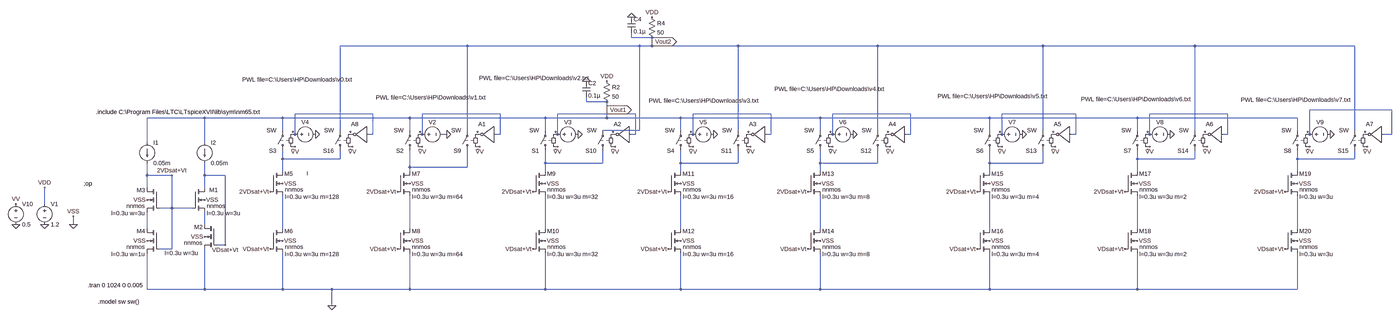
[diagram p0: schematic Sin DAC Differential.asc, whole sheet]
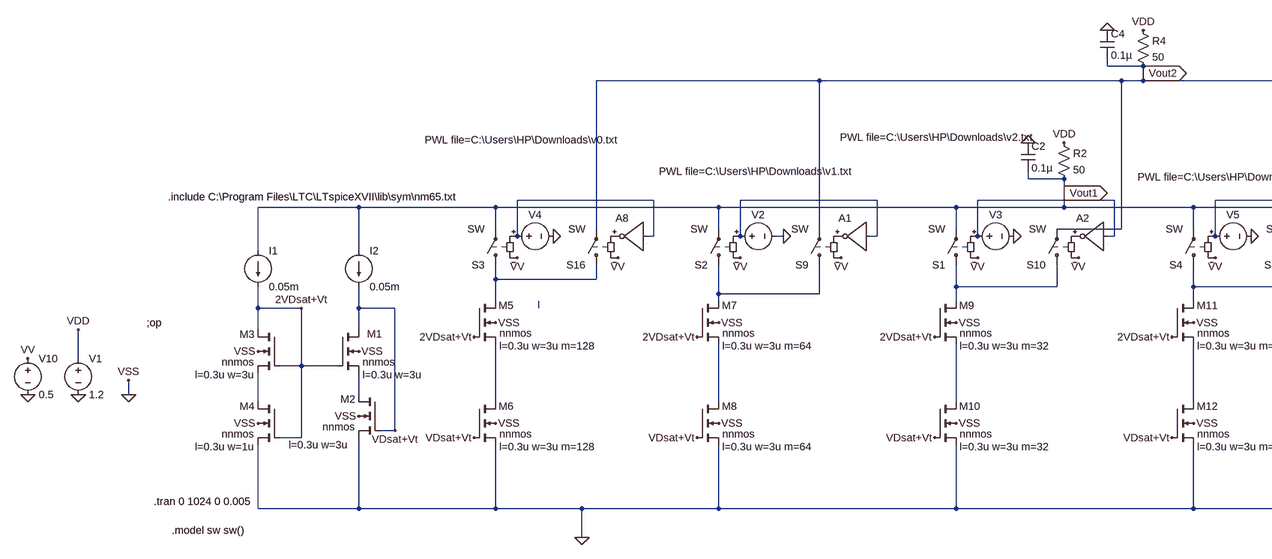
[diagram p1: schematic Sin DAC Differential.asc, part, row 1 of 1, column 1 of 2]
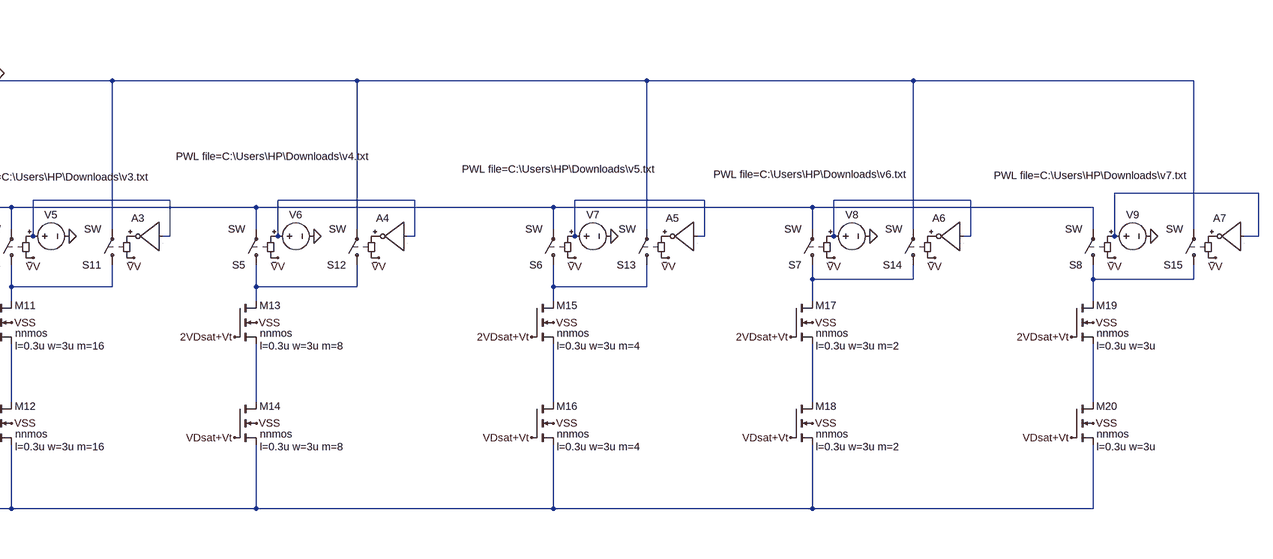
[diagram p2: schematic Sin DAC Differential.asc, part, row 1 of 1, column 2 of 2]
Sin DAC Differential.asc, the LTspice schematic file:
Version 4
SHEET 1 3460 680
WIRE 480 -576 480 -592
WIRE 560 -576 480 -576
WIRE 560 -560 560 -576
WIRE -160 -544 -656 -544
WIRE 512 -544 -160 -544
WIRE 560 -544 560 -560
WIRE 560 -544 512 -544
WIRE 896 -544 560 -544
WIRE 1440 -544 896 -544
WIRE 2096 -544 1440 -544
WIRE 2688 -544 2096 -544
WIRE 3312 -544 2688 -544
WIRE 304 -304 304 -320
WIRE 384 -304 304 -304
WIRE 384 -272 384 -304
WIRE 3456 -272 3136 -272
WIRE -528 -256 -832 -256
WIRE -32 -256 -336 -256
WIRE 496 -256 192 -256
WIRE 1024 -256 720 -256
WIRE 1568 -256 1264 -256
WIRE 2224 -256 1936 -256
WIRE 2816 -256 2512 -256
WIRE -1184 -240 -1408 -240
WIRE -880 -240 -1184 -240
WIRE -384 -240 -880 -240
WIRE 144 -240 -384 -240
WIRE 384 -240 384 -272
WIRE 384 -240 144 -240
WIRE 672 -240 384 -240
WIRE 1216 -240 672 -240
WIRE 1888 -240 1216 -240
WIRE 2464 -240 1888 -240
WIRE 3088 -240 2464 -240
WIRE -880 -192 -880 -240
WIRE -656 -192 -656 -544
WIRE -384 -192 -384 -240
WIRE -160 -192 -160 -544
WIRE 144 -192 144 -240
WIRE 512 -192 512 -544
WIRE 512 -192 368 -192
WIRE 672 -192 672 -240
WIRE 896 -192 896 -544
WIRE 1216 -192 1216 -240
WIRE 1440 -192 1440 -544
WIRE 1888 -192 1888 -240
WIRE 2096 -192 2096 -544
WIRE 2464 -192 2464 -240
WIRE 2688 -192 2688 -544
WIRE 3088 -192 3088 -240
WIRE 3312 -192 3312 -544
WIRE -832 -176 -832 -256
WIRE -528 -176 -528 -256
WIRE -528 -176 -544 -176
WIRE -336 -176 -336 -256
WIRE -240 -176 -256 -176
WIRE -32 -176 -32 -256
WIRE -32 -176 -48 -176
WIRE 192 -176 192 -256
WIRE 496 -176 496 -256
WIRE 496 -176 480 -176
WIRE 720 -176 720 -256
WIRE 1024 -176 1024 -256
WIRE 1024 -176 1008 -176
WIRE 1264 -176 1264 -256
WIRE 1568 -176 1568 -256
WIRE 1568 -176 1552 -176
WIRE 1936 -176 1936 -256
WIRE 2224 -176 2224 -256
WIRE 2224 -176 2208 -176
WIRE 2512 -176 2512 -256
WIRE 2816 -176 2816 -256
WIRE 2816 -176 2800 -176
WIRE 3136 -176 3136 -272
WIRE 3456 -176 3456 -272
WIRE 3456 -176 3424 -176
WIRE -1408 -144 -1408 -240
WIRE -1184 -144 -1184 -240
WIRE -880 -80 -880 -112
WIRE -656 -80 -656 -112
WIRE -656 -80 -880 -80
WIRE 2464 -80 2464 -112
WIRE 2688 -80 2688 -112
WIRE 2688 -80 2464 -80
WIRE 3088 -80 3088 -112
WIRE 3312 -80 3312 -112
WIRE 3312 -80 3088 -80
WIRE 144 -64 144 -112
WIRE 368 -64 368 -112
WIRE 368 -64 144 -64
WIRE 672 -64 672 -112
WIRE 896 -64 896 -112
WIRE 896 -64 672 -64
WIRE 1216 -64 1216 -112
WIRE 1440 -64 1440 -112
WIRE 1440 -64 1216 -64
WIRE 1888 -64 1888 -112
WIRE 2096 -64 2096 -112
WIRE 2096 -64 1888 -64
WIRE -384 -48 -384 -112
WIRE -160 -48 -160 -112
WIRE -160 -48 -384 -48
WIRE -880 -32 -880 -80
WIRE -384 -32 -384 -48
WIRE 144 -32 144 -64
WIRE 672 -32 672 -64
WIRE 1216 -32 1216 -64
WIRE 1888 -32 1888 -64
WIRE 2464 -32 2464 -80
WIRE 3088 -32 3088 -80
WIRE -1408 -16 -1408 -64
WIRE -1312 -16 -1408 -16
WIRE -1184 -16 -1184 -64
WIRE -1104 -16 -1184 -16
WIRE -784 -16 -784 -32
WIRE -1408 32 -1408 -16
WIRE -1184 32 -1184 -16
WIRE -1808 96 -1808 32
WIRE -1312 112 -1312 -16
WIRE -1312 112 -1360 112
WIRE -1232 112 -1312 112
WIRE -1696 176 -1696 144
WIRE -1184 176 -1184 128
WIRE -1408 192 -1408 128
WIRE -880 192 -880 64
WIRE -384 192 -384 64
WIRE 144 192 144 64
WIRE 672 192 672 64
WIRE 1216 192 1216 64
WIRE 1888 192 1888 64
WIRE 2464 192 2464 64
WIRE 3088 192 3088 64
WIRE -1104 256 -1104 -16
WIRE -1104 256 -1136 256
WIRE -1312 272 -1312 112
WIRE -1312 272 -1360 272
WIRE -1408 480 -1408 288
WIRE -1184 480 -1184 272
WIRE -1184 480 -1408 480
WIRE -880 480 -880 288
WIRE -880 480 -1184 480
WIRE -688 480 -880 480
WIRE -384 480 -384 288
WIRE -384 480 -688 480
WIRE 144 480 144 288
WIRE 144 480 -384 480
WIRE 672 480 672 288
WIRE 672 480 144 480
WIRE 1216 480 1216 288
WIRE 1216 480 672 480
WIRE 1888 480 1888 288
WIRE 1888 480 1216 480
WIRE 2464 480 2464 288
WIRE 2464 480 1888 480
WIRE 3088 480 3088 288
WIRE 3088 480 2464 480
WIRE -688 544 -688 480
FLAG -1696 176 0
FLAG -1184 80 VSS
FLAG -1184 224 VSS
FLAG -1408 80 VSS
FLAG -1408 240 VSS
FLAG -880 16 VSS
FLAG -880 240 VSS
FLAG -1696 144 VSS
FLAG -1312 -16 2VDsat+Vt
FLAG -928 48 2VDsat+Vt
FLAG -1104 256 VDsat+Vt
FLAG -1808 176 0
FLAG -1808 32 VDD
FLAG -384 16 VSS
FLAG -384 240 VSS
FLAG -432 48 2VDsat+Vt
FLAG 144 16 VSS
FLAG 144 240 VSS
FLAG 96 48 2VDsat+Vt
FLAG -432 272 VDsat+Vt
FLAG 96 272 VDsat+Vt
FLAG -752 -176 0
FLAG -240 -176 0
FLAG 272 -176 0
FLAG -928 272 VDsat+Vt
FLAG 672 16 VSS
FLAG 672 240 VSS
FLAG 624 48 2VDsat+Vt
FLAG 624 272 VDsat+Vt
FLAG 800 -176 0
FLAG 1216 16 VSS
FLAG 1216 240 VSS
FLAG 1168 48 2VDsat+Vt
FLAG 1168 272 VDsat+Vt
FLAG 1344 -176 0
FLAG 1888 16 VSS
FLAG 1888 240 VSS
FLAG 1840 48 2VDsat+Vt
FLAG 1840 272 VDsat+Vt
FLAG 2016 -176 0
FLAG 2464 16 VSS
FLAG 2464 240 VSS
FLAG 2416 48 2VDsat+Vt
FLAG 2416 272 VDsat+Vt
FLAG 2592 -176 0
FLAG 3088 16 VSS
FLAG 3088 240 VSS
FLAG 3040 48 2VDsat+Vt
FLAG 3040 272 VDsat+Vt
FLAG 3216 -176 0
FLAG -688 544 0
FLAG -1920 176 0
FLAG -1920 96 VV
FLAG -832 -128 VV
FLAG -336 -128 VV
FLAG 192 -128 VV
FLAG 720 -128 VV
FLAG 1264 -128 VV
FLAG 1936 -128 VV
FLAG 2512 -128 VV
FLAG 3136 -128 VV
FLAG 384 -384 VDD
FLAG 384 -272 Vout1
IOPIN 384 -272 Out
FLAG 304 -384 0
FLAG 560 -656 VDD
FLAG 480 -656 0
FLAG -112 -128 VV
FLAG 416 -128 VV
FLAG 944 -128 VV
FLAG 1488 -128 VV
FLAG 2144 -128 VV
FLAG 2736 -128 VV
FLAG 3360 -128 VV
FLAG -608 -128 VV
FLAG 560 -560 Vout2
IOPIN 560 -560 Out
SYMBOL nmos4 -1232 32 R0
WINDOW 123 56 100 Left 2
WINDOW 0 66 9 Left 2
SYMATTR Value2 l=0.3u w=3u
SYMATTR InstName M1
SYMATTR Value nnmos
SYMBOL nmos4 -1136 176 M0
WINDOW 123 72 112 Left 2
WINDOW 0 55 10 Left 2
SYMATTR Value2 l=0.3u w=3u
SYMATTR InstName M2
SYMATTR Value nnmos
SYMBOL nmos4 -1360 32 M0
WINDOW 123 56 100 Left 2
WINDOW 0 55 10 Left 2
SYMATTR Value2 l=0.3u w=3u
SYMATTR InstName M3
SYMATTR Value nnmos
SYMBOL nmos4 -1360 192 M0
WINDOW 123 56 100 Left 2
WINDOW 0 55 10 Left 2
SYMATTR Value2 l=0.3u w=1u
SYMATTR InstName M4
SYMATTR Value nnmos
SYMBOL nmos4 -928 -32 R0
WINDOW 123 56 100 Left 2
WINDOW 0 55 10 Left 2
SYMATTR Value2 l=0.3u w=3u m=128
SYMATTR InstName M5
SYMATTR Value nnmos
SYMBOL nmos4 -928 192 R0
WINDOW 123 56 100 Left 2
WINDOW 0 55 10 Left 2
SYMATTR Value2 l=0.3u w=3u m=128
SYMATTR InstName M6
SYMATTR Value nnmos
SYMBOL current -1408 -144 R0
WINDOW 123 0 0 Left 0
WINDOW 39 0 0 Left 0
SYMATTR InstName I1
SYMATTR Value 0.05m
SYMBOL current -1184 -144 R0
WINDOW 123 0 0 Left 0
WINDOW 39 0 0 Left 0
SYMATTR InstName I2
SYMATTR Value 0.05m
SYMBOL voltage -1808 80 R0
WINDOW 123 0 0 Left 0
WINDOW 39 0 0 Left 0
SYMATTR InstName V1
SYMATTR Value 1.2
SYMBOL nmos4 -432 -32 R0
WINDOW 123 56 100 Left 2
WINDOW 0 55 10 Left 2
SYMATTR Value2 l=0.3u w=3u m=64
SYMATTR InstName M7
SYMATTR Value nnmos
SYMBOL nmos4 -432 192 R0
WINDOW 123 56 100 Left 2
WINDOW 0 55 10 Left 2
SYMATTR Value2 l=0.3u w=3u m=64
SYMATTR InstName M8
SYMATTR Value nnmos
SYMBOL nmos4 96 -32 R0
WINDOW 123 56 100 Left 2
WINDOW 0 55 10 Left 2
SYMATTR Value2 l=0.3u w=3u m=32
SYMATTR InstName M9
SYMATTR Value nnmos
SYMBOL nmos4 96 192 R0
WINDOW 123 56 100 Left 2
WINDOW 0 55 10 Left 2
SYMATTR Value2 l=0.3u w=3u m=32
SYMATTR InstName M10
SYMATTR Value nnmos
SYMBOL voltage -352 -176 M90
WINDOW 0 -32 56 VBottom 2
WINDOW 3 -160 49 VTop 2
WINDOW 123 0 0 Left 0
WINDOW 39 0 0 Left 0
SYMATTR InstName V2
SYMATTR Value PWL file=C:\Users\HP\Downloads\v1.txt
SYMBOL voltage 176 -176 M90
WINDOW 0 -32 56 VBottom 2
WINDOW 3 -236 -76 VTop 2
WINDOW 123 0 0 Left 0
WINDOW 39 0 0 Left 0
SYMATTR InstName V3
SYMATTR Value PWL file=C:\Users\HP\Downloads\v2.txt
SYMBOL voltage -848 -176 M90
WINDOW 0 -32 56 VBottom 2
WINDOW 3 -230 24 VTop 2
WINDOW 123 0 0 Left 0
WINDOW 39 0 0 Left 0
SYMATTR InstName V4
SYMATTR Value PWL file=C:\Users\HP\Downloads\v0.txt
SYMBOL sw 144 -96 R180
SYMATTR InstName S1
SYMBOL sw -384 -96 R180
SYMATTR InstName S2
SYMBOL sw -880 -96 R180
SYMATTR InstName S3
SYMBOL nmos4 624 -32 R0
WINDOW 123 56 100 Left 2
WINDOW 0 55 10 Left 2
SYMATTR Value2 l=0.3u w=3u m=16
SYMATTR InstName M11
SYMATTR Value nnmos
SYMBOL nmos4 624 192 R0
WINDOW 123 56 100 Left 2
WINDOW 0 55 10 Left 2
SYMATTR Value2 l=0.3u w=3u m=16
SYMATTR InstName M12
SYMATTR Value nnmos
SYMBOL voltage 704 -176 M90
WINDOW 0 -32 56 VBottom 2
WINDOW 3 -147 57 VTop 2
WINDOW 123 0 0 Left 0
WINDOW 39 0 0 Left 0
SYMATTR InstName V5
SYMATTR Value PWL file=C:\Users\HP\Downloads\v3.txt
SYMBOL sw 672 -96 R180
SYMATTR InstName S4
SYMBOL nmos4 1168 -32 R0
WINDOW 123 56 100 Left 2
WINDOW 0 55 10 Left 2
SYMATTR Value2 l=0.3u w=3u m=8
SYMATTR InstName M13
SYMATTR Value nnmos
SYMBOL nmos4 1168 192 R0
WINDOW 123 56 100 Left 2
WINDOW 0 55 10 Left 2
SYMATTR Value2 l=0.3u w=3u m=8
SYMATTR InstName M14
SYMATTR Value nnmos
SYMBOL voltage 1248 -176 M90
WINDOW 0 -32 56 VBottom 2
WINDOW 3 -193 3 VTop 2
WINDOW 123 0 0 Left 0
WINDOW 39 0 0 Left 0
SYMATTR InstName V6
SYMATTR Value PWL file=C:\Users\HP\Downloads\v4.txt
SYMBOL sw 1216 -96 R180
SYMATTR InstName S5
SYMBOL nmos4 1840 -32 R0
WINDOW 123 56 100 Left 2
WINDOW 0 55 10 Left 2
SYMATTR Value2 l=0.3u w=3u m=4
SYMATTR InstName M15
SYMATTR Value nnmos
SYMBOL nmos4 1840 192 R0
WINDOW 123 56 100 Left 2
WINDOW 0 55 10 Left 2
SYMATTR Value2 l=0.3u w=3u m=4
SYMATTR InstName M16
SYMATTR Value nnmos
SYMBOL voltage 1920 -176 M90
WINDOW 0 -32 56 VBottom 2
WINDOW 3 -165 -21 VTop 2
WINDOW 123 0 0 Left 0
WINDOW 39 0 0 Left 0
SYMATTR InstName V7
SYMATTR Value PWL file=C:\Users\HP\Downloads\v5.txt
SYMBOL sw 1888 -96 R180
SYMATTR InstName S6
SYMBOL nmos4 2416 -32 R0
WINDOW 123 56 100 Left 2
WINDOW 0 55 10 Left 2
SYMATTR Value2 l=0.3u w=3u m=2
SYMATTR InstName M17
SYMATTR Value nnmos
SYMBOL nmos4 2416 192 R0
WINDOW 123 56 100 Left 2
WINDOW 0 55 10 Left 2
SYMATTR Value2 l=0.3u w=3u m=2
SYMATTR InstName M18
SYMATTR Value nnmos
SYMBOL voltage 2496 -176 M90
WINDOW 0 -32 56 VBottom 2
WINDOW 3 -153 -38 VTop 2
WINDOW 123 0 0 Left 0
WINDOW 39 0 0 Left 0
SYMATTR InstName V8
SYMATTR Value PWL file=C:\Users\HP\Downloads\v6.txt
SYMBOL sw 2464 -96 R180
SYMATTR InstName S7
SYMBOL nmos4 3040 -32 R0
WINDOW 123 56 100 Left 2
WINDOW 0 55 10 Left 2
SYMATTR Value2 l=0.3u w=3u
SYMATTR InstName M19
SYMATTR Value nnmos
SYMBOL nmos4 3040 192 R0
WINDOW 123 56 100 Left 2
WINDOW 0 55 10 Left 2
SYMATTR Value2 l=0.3u w=3u
SYMATTR InstName M20
SYMATTR Value nnmos
SYMBOL voltage 3120 -176 M90
WINDOW 0 -32 56 VBottom 2
WINDOW 3 -151 -39 VTop 2
WINDOW 123 0 0 Left 0
WINDOW 39 0 0 Left 0
SYMATTR InstName V9
SYMATTR Value PWL file=C:\Users\HP\Downloads\v7.txt
SYMBOL sw 3088 -96 R180
SYMATTR InstName S8
SYMBOL voltage -1920 80 R0
WINDOW 123 0 0 Left 0
WINDOW 39 0 0 Left 0
SYMATTR InstName V10
SYMATTR Value 0.5
SYMBOL sw -160 -96 R180
SYMATTR InstName S9
SYMBOL sw 368 -96 R180
SYMATTR InstName S10
SYMBOL sw 896 -96 R180
SYMATTR InstName S11
SYMBOL sw 1440 -96 R180
SYMATTR InstName S12
SYMBOL sw 2096 -96 R180
SYMATTR InstName S13
SYMBOL sw 2688 -96 R180
SYMATTR InstName S14
SYMBOL sw 3312 -96 R180
SYMATTR InstName S15
SYMBOL cap 288 -384 R0
SYMATTR InstName C2
SYMATTR Value 0.1µ
SYMBOL res 368 -400 R0
SYMATTR InstName R2
SYMATTR Value 50
SYMBOL cap 464 -656 R0
SYMATTR InstName C4
SYMATTR Value 0.1µ
SYMBOL res 544 -672 R0
SYMATTR InstName R4
SYMATTR Value 50
SYMBOL Digital\\inv -48 -240 M0
SYMATTR InstName A1
SYMBOL Digital\\inv 480 -240 M0
SYMATTR InstName A2
SYMBOL Digital\\inv 1008 -240 M0
SYMATTR InstName A3
SYMBOL Digital\\inv 1552 -240 M0
SYMATTR InstName A4
SYMBOL Digital\\inv 2208 -240 M0
SYMATTR InstName A5
SYMBOL Digital\\inv 2800 -240 M0
SYMATTR InstName A6
SYMBOL Digital\\inv 3424 -240 M0
SYMATTR InstName A7
SYMBOL sw -656 -96 R180
SYMATTR InstName S16
SYMBOL Digital\\inv -544 -240 M0
SYMATTR InstName A8
TEXT -1608 -264 Left 2 !.include C:\\Program Files\\LTC\\LTspiceXVII\\lib\\sym\\nm65.txt
TEXT -1656 16 Left 2 !;op
TEXT -1640 464 Left 2 !.tran 0 1024 0 0.005
TEXT -1600 528 Left 2 !.model sw sw()

The netlist it stands for:
* Sin DAC Differential.asc
M1 VDsat+Vt 2VDsat+Vt N018 0 nnmos l=0.3u w=3u
M2 N018 VDsat+Vt 0 0 nnmos l=0.3u w=3u
M3 2VDsat+Vt 2VDsat+Vt N019 0 nnmos l=0.3u w=3u
M4 N019 2VDsat+Vt 0 0 nnmos l=0.3u w=1u
M5 N009 2VDsat+Vt N020 0 nnmos l=0.3u w=3u m=128
M6 N020 VDsat+Vt 0 0 nnmos l=0.3u w=3u m=128
I1 Vout1 2VDsat+Vt 0.05m
I2 Vout1 VDsat+Vt 0.05m
V1 VDD 0 1.2
M7 N016 2VDsat+Vt N021 0 nnmos l=0.3u w=3u m=64
M8 N021 VDsat+Vt 0 0 nnmos l=0.3u w=3u m=64
M9 N012 2VDsat+Vt N022 0 nnmos l=0.3u w=3u m=32
M10 N022 VDsat+Vt 0 0 nnmos l=0.3u w=3u m=32
V2 N003 0 PWL file=C:\Users\HP\Downloads\v1.txt
V3 N004 0 PWL file=C:\Users\HP\Downloads\v2.txt
V4 N002 0 PWL file=C:\Users\HP\Downloads\v0.txt
S1 N012 Vout1 N004 VV SW
S2 N016 Vout1 N003 VV SW
S3 N009 Vout1 N002 VV SW
M11 N013 2VDsat+Vt N023 0 nnmos l=0.3u w=3u m=16
M12 N023 VDsat+Vt 0 0 nnmos l=0.3u w=3u m=16
V5 N005 0 PWL file=C:\Users\HP\Downloads\v3.txt
S4 N013 Vout1 N005 VV SW
M13 N014 2VDsat+Vt N024 0 nnmos l=0.3u w=3u m=8
M14 N024 VDsat+Vt 0 0 nnmos l=0.3u w=3u m=8
V6 N006 0 PWL file=C:\Users\HP\Downloads\v4.txt
S5 N014 Vout1 N006 VV SW
M15 N015 2VDsat+Vt N025 0 nnmos l=0.3u w=3u m=4
M16 N025 VDsat+Vt 0 0 nnmos l=0.3u w=3u m=4
V7 N007 0 PWL file=C:\Users\HP\Downloads\v5.txt
S6 N015 Vout1 N007 VV SW
M17 N010 2VDsat+Vt N026 0 nnmos l=0.3u w=3u m=2
M18 N026 VDsat+Vt 0 0 nnmos l=0.3u w=3u m=2
V8 N008 0 PWL file=C:\Users\HP\Downloads\v6.txt
S7 N010 Vout1 N008 VV SW
M19 N011 2VDsat+Vt N027 0 nnmos l=0.3u w=3u
M20 N027 VDsat+Vt 0 0 nnmos l=0.3u w=3u
V9 N001 0 PWL file=C:\Users\HP\Downloads\v7.txt
S8 N011 Vout1 N001 VV SW
V10 VV 0 0.5
S9 N016 Vout2 P001 VV SW
S10 N012 Vout2 P002 VV SW
S11 N013 Vout2 P003 VV SW
S12 N014 Vout2 P004 VV SW
S13 N015 Vout2 P005 VV SW
S14 N010 Vout2 P006 VV SW
S15 N011 Vout2 P007 VV SW
C2 0 Vout1 0.1µ
R2 VDD Vout1 50
C4 0 Vout2 0.1µ
R4 VDD Vout2 50
A1 N003 0 0 0 0 P001 0 0 BUF
A2 N004 0 0 0 0 P002 0 0 BUF
A3 N005 0 0 0 0 P003 0 0 BUF
A4 N006 0 0 0 0 P004 0 0 BUF
A5 N007 0 0 0 0 P005 0 0 BUF
A6 N008 0 0 0 0 P006 0 0 BUF
A7 N001 0 0 0 0 P007 0 0 BUF
S16 N009 Vout2 P008 VV SW
A8 N002 0 0 0 0 P008 0 0 BUF
.model NMOS NMOS
.model PMOS PMOS
.lib standard.mos
.include C:\Program Files\LTC\LTspiceXVII\lib\sym\nm65.txt
;op
.tran 0 1024 0 0.005
.model sw sw()
.backanno
.end